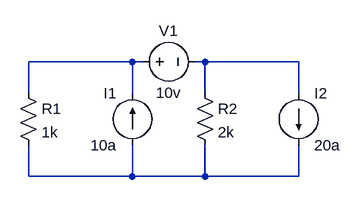
[diagram p0: schematic Draft1.asc]
Draft1.asc, the LTspice schematic file:
Version 4
SHEET 1 880 680
WIRE 160 80 0 80
WIRE 176 80 160 80
WIRE 272 80 256 80
WIRE 416 80 272 80
WIRE 0 128 0 80
WIRE 160 128 160 80
WIRE 272 128 272 80
WIRE 416 128 416 80
WIRE 0 256 0 208
WIRE 160 256 160 208
WIRE 160 256 0 256
WIRE 272 256 272 208
WIRE 272 256 160 256
WIRE 416 256 416 208
WIRE 416 256 272 256
SYMBOL res -16 112 R0
SYMATTR InstName R1
SYMATTR Value 1k
SYMBOL res 256 112 R0
SYMATTR InstName R2
SYMATTR Value 2k
SYMBOL current 160 208 R180
WINDOW 0 24 80 Left 2
WINDOW 3 24 0 Left 2
SYMATTR InstName I1
SYMATTR Value 10a
SYMBOL current 416 128 R0
SYMATTR InstName I2
SYMATTR Value 20a
SYMBOL voltage 160 80 R270
WINDOW 0 32 56 VTop 2
WINDOW 3 -32 56 VBottom 2
SYMATTR InstName V1
SYMATTR Value 10v

The netlist it stands for:
* Draft1.asc
R1 N001 N003 1k
R2 N002 N003 2k
I1 N003 N001 10a
I2 N002 N003 20a
V1 N001 N002 10v
.backanno
.end